# EAGLE design brick_i2c_3axis_MMA8451 (EAGLE 7.2.0)
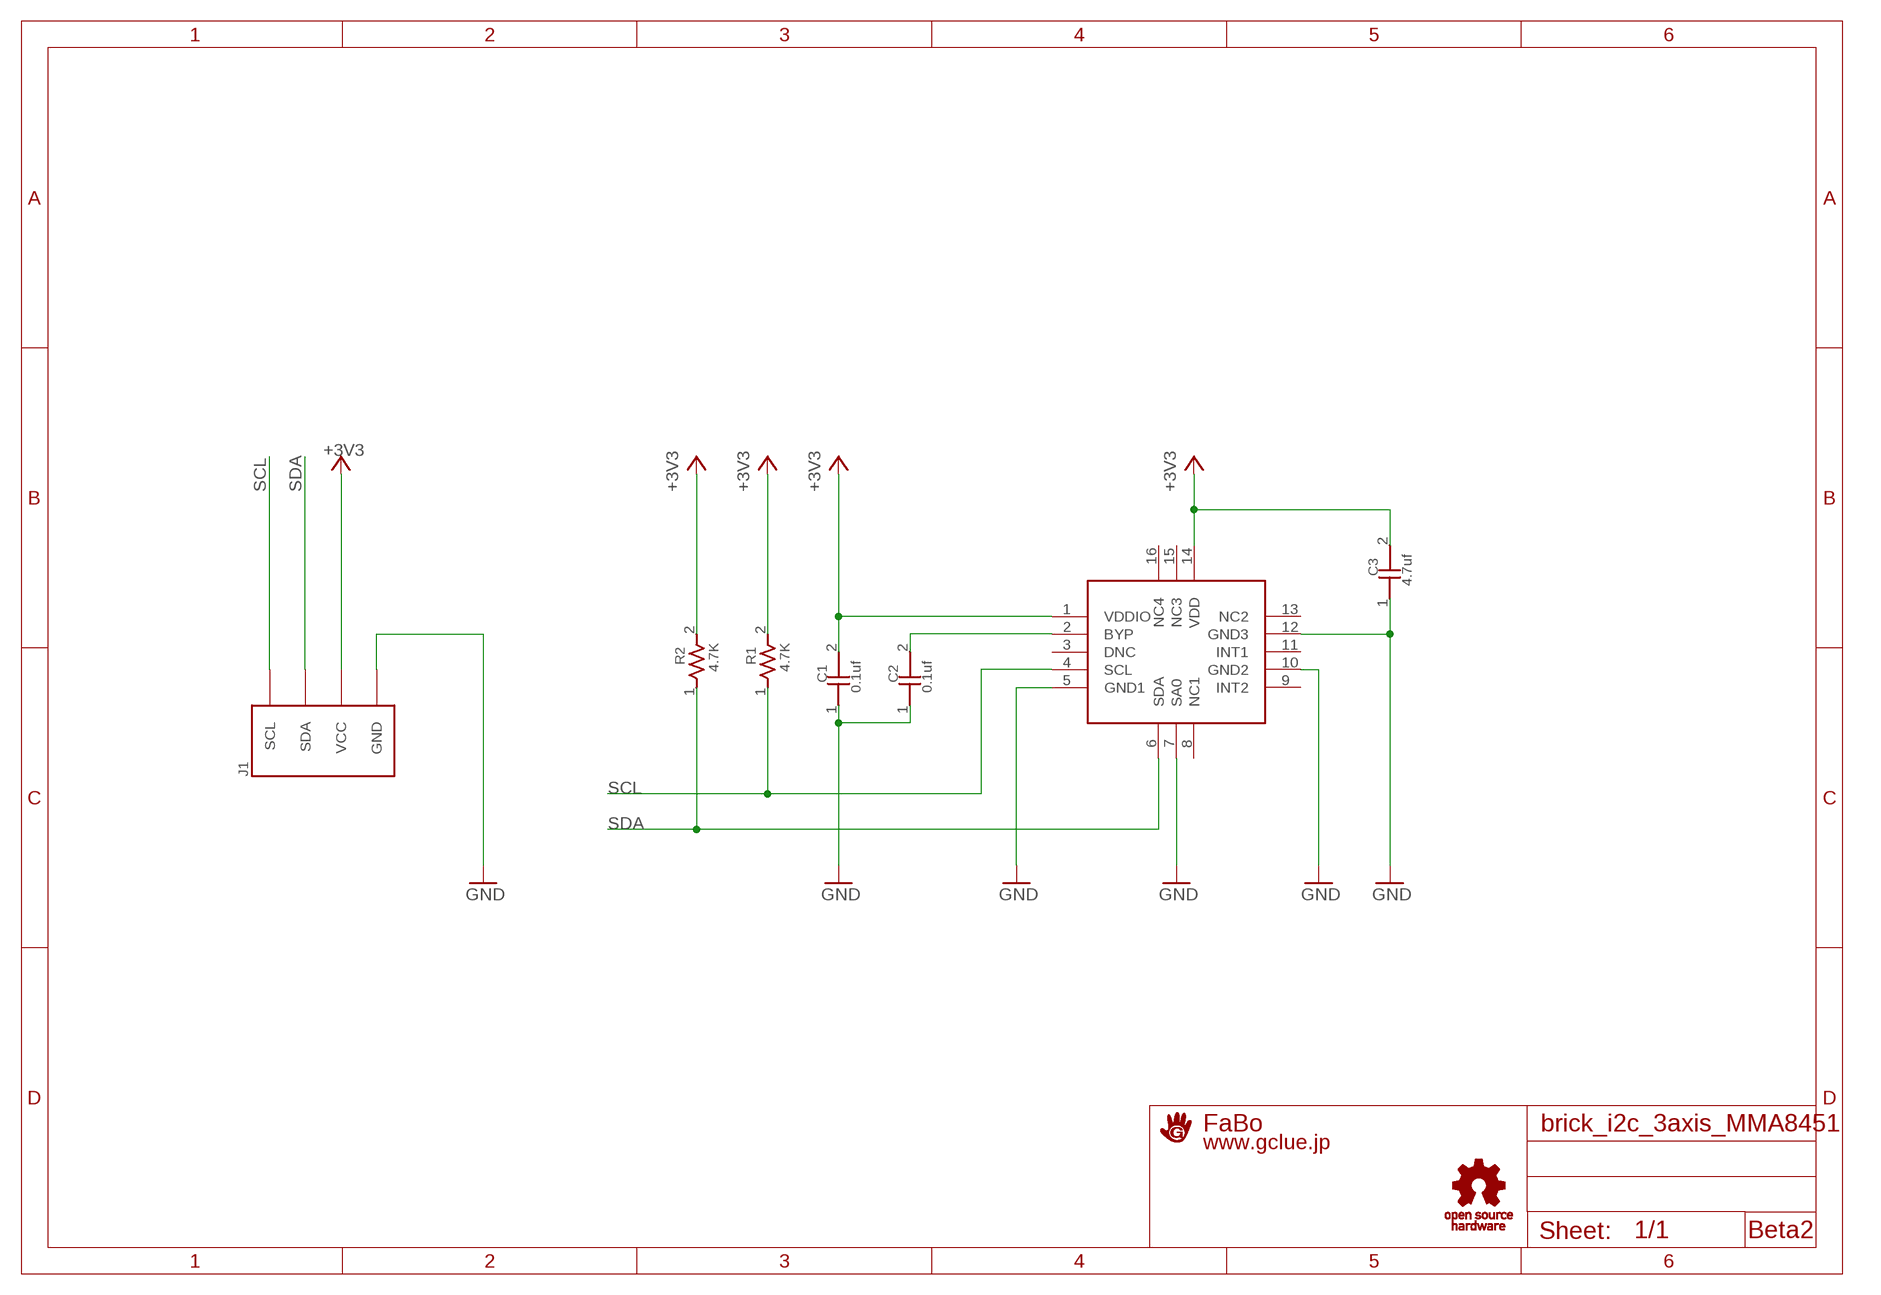
[diagram p0: schematic, sheet 1]

## Parts
C1  0.1uf  CAPACITOR0603  [0603]
C2  0.1uf  CAPACITOR0603  [0603]
C3  4.7uf  CAPACITOR0603  [0603]
J1  BRICK_I2C  [BRICK_I2C]
MMA1  FREESCALE-MMA8451Q  [FREESCALE-MMA8451Q]
R1  4.7K  RESISTOR0603  [0603]
R2  4.7K  RESISTOR0603  [0603]
U$1  LOGO_OSHW_T-M  [LOGO_OSHW_T_M]
U$2  A4L-LOC-FABO_M  [LOGO_FABO_M]

## Nets
+3V3: C1.2 C3.2 J1.VCC MMA1.1(VDDIO) MMA1.14(VDD) R1.2 R2.2
GND: C1.1 C2.1 C3.1 J1.GND MMA1.5(GND1) MMA1.7(SA0) MMA1.10(GND2) MMA1.12(GND3)
N$1: C2.2 MMA1.2(BYP)
SCL: J1.SCL MMA1.4(SCL) R1.1
SDA: J1.SDA MMA1.6(SDA) R2.1
Unconnected: MMA1.3(DNC) MMA1.8(NC1) MMA1.9(INT2) MMA1.11(INT1) MMA1.13(NC2) MMA1.15(NC3) MMA1.16(NC4)

## Notes on the sheet
- Beta2

## Library data of the parts
C1-C3 = GClue-Capacitor:CAPACITOR
J1 = gclue:BRICK_I2C: FaBo Brick 4pin(I2C)
MMA1 = GClue-Mems:FREESCALE-MMA8451Q
R1 R2 = GClue-Resistors:RESISTOR
U$1 = gclue:LOGO_OSHW_T
U$2 = gclue:A4L-LOC: FaBo A4 FRAME

## Board
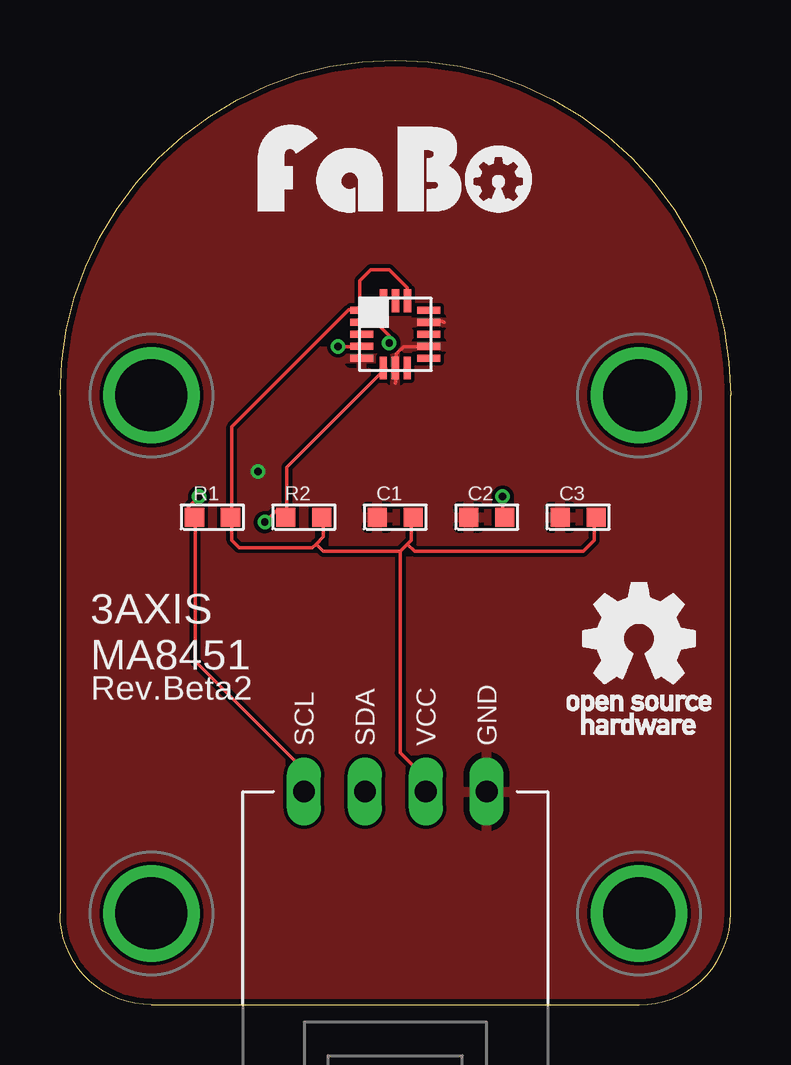
[diagram p1: board, top side]
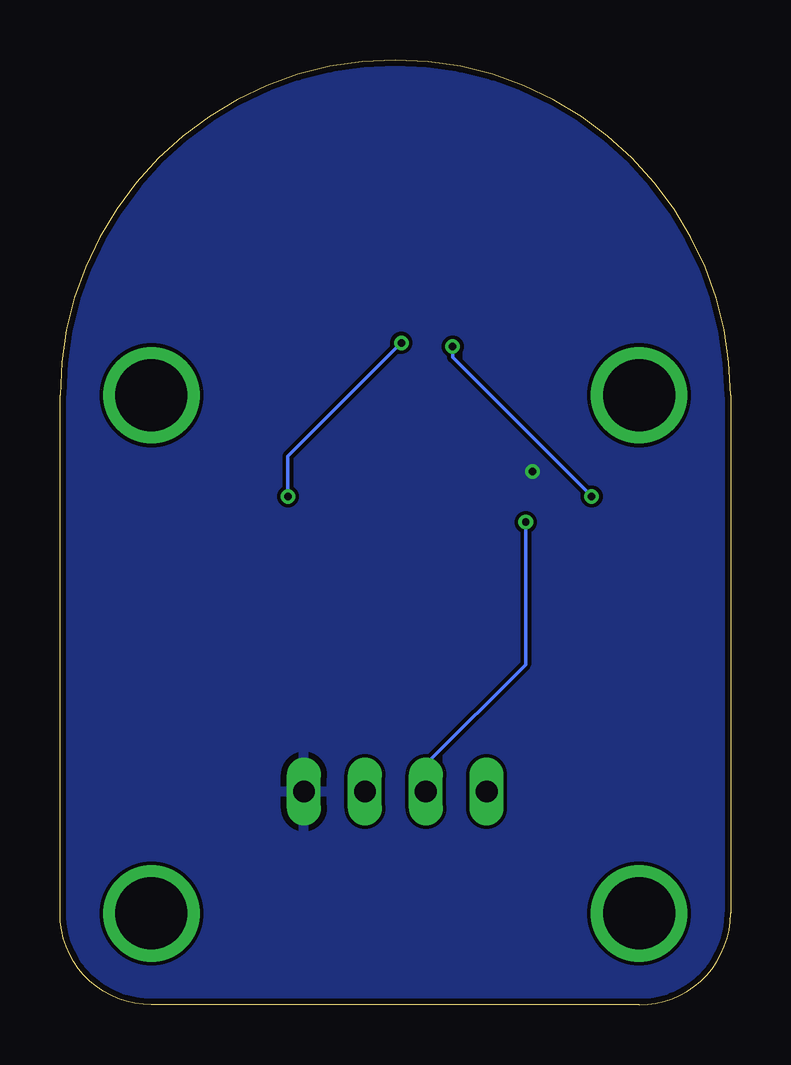
[diagram p2: board, bottom side, seen from below]

Size 27.94 x 39.37 mm. Coordinates in mm from the lower left corner, seen from the top.
Copper layers (1*16): Top 0.035mm / dielectric 1.5mm / Bottom 0.035mm
Design rules "Elecrow_2-layer_eagle_rule": minimum track width 6mil, minimum drill 12mil, track to track 6mil, track to pad 6mil, pad to pad 6mil, via to via 6mil, smd to smd 0mil, copper to edge 10mil, drill to drill 10mil, minimum pad ring 10mil, minimum via ring 6mil, stop-mask expansion 2mil, vias tented up to drill 100mil, thermal gap 10mil

### Footprints (pad centres in the part's own frame; a part is rotated, then mirrored left to right if it is on the bottom)
0603 = smd 0.8 x 0.8: 1 -0.75,0; 2 0.75,0
BRICK_I2C = drill 0.9 long: GND 3.81,-10.16; SCL -3.81,-10.16; SDA -1.27,-10.16; VCC 1.27,-10.16 | drill 3 pad 3.81: P$1 -10.16,6.35; P$2 10.16,6.35; P$3 -10.16,-15.24; P$4 10.16,-15.24
FREESCALE-MMA8451Q = smd 0.95 x 0.305: 1 -1.4,1; 2 -1.4,0.5; 3 -1.4,0; 4 -1.4,-0.5; 5 -1.4,-1; 9 1.4,-1; 10 1.4,-0.5; 11 1.4,0; 12 1.4,0.5; 13 1.4,1 | smd 0.305 x 0.95: 6 -0.5,-1.4; 7 0,-1.4; 8 0.5,-1.4; 14 0.51,1.4; 15 0.01,1.4; 16 -0.49,1.4

### Placement (x,y rotation side)
C1  13.97,20.32 0 top
C2  17.78,20.32 0 top
C3  21.59,20.32 0 top
J1  13.97,19.05 0 top
MMA1  13.97,27.94 0 top
R1  6.35,20.32 0 top
R2  10.16,20.32 0 top
U$1  24.13,15.24 0 top
U$3  [LOGO_FABO_M]  13.97,33.02 0 top

### Tracks (layer width: path | path; a pad name or v marks a point on that pad's centre or on a via)
+3V3
  Top 0.152: 12.5,28.96 12.5,30.18 12.95,30.63 13.72,30.63 14.48,29.87 14.48,29.41 MMA1.14 | 10.67,19.2 10.97,19.51 10.97,20.27 R2.2 | 10.67,19.2 10.52,19.05 7.47,19.05 7.16,19.36 7.16,20.27 R1.2 7.16,20.42 7.16,24.08 12.04,28.96 12.5,28.96 | 14.17,18.9 14.48,19.2 | 14.48,19.2 14.63,19.36 14.63,20.27 C1.2 | 14.17,18.9 10.97,18.9 10.67,19.2 | 14.48,19.2 14.78,18.9 21.79,18.9 22.25,19.36 22.25,20.27 C3.2 | 12.5,28.96 MMA1.1 | J1.VCC 15.24,9.45 14.17,10.52 14.17,18.9
GND  (via drill 0.3)
  Top 0.152: 13.97,25.91 14.02,26.06 14.02,26.52 MMA1.7 14.02,26.67 14.02,27.13 14.33,27.43 15.24,27.43 MMA1.10 | MMA1.12 15.39,28.5 15.85,28.5 16,28.44
  other vias: 8.26,22.23
  pour Bottom: -1.27,-1.27 29.21,-1.27 29.21,40.64 -1.27,40.64
  pour Top: -1.27,-1.27 29.21,-1.27 29.21,40.64 -1.27,40.64
N$1  (via drill 0.3)
  Top 0.152: v18.44,21.18 18.44,20.42 C2.2 | v13.72,27.58 13.72,27.89 13.26,28.35 12.65,28.35 MMA1.2
  Bottom 0.152: v18.44,21.18 18.44,22.86 v13.72,27.58
SCL  (via drill 0.3)
  Top 0.152: J1.SCL 10.06,8.99 10.06,9.91 5.64,14.33 5.64,20.27 R1.1 5.49,20.42 5.33,20.57 5.33,20.73 v5.79,21.18 | v11.58,27.43 12.5,27.43 MMA1.4
  Bottom 0.152: v11.58,27.43 11.58,26.98 v5.79,21.18
SDA  (via drill 0.3)
  Top 0.152: 9.45,20.57 9.45,22.4 13.56,26.52 MMA1.6 | 9.45,20.57 9.45,20.42 R2.1 9.45,20.57 | v8.53,20.12 8.99,20.57 9.45,20.57
  Bottom 0.152: v8.53,20.12 8.53,14.17 12.65,10.06 12.65,8.99 J1.SDA

### Text on the board
tPlace: 3AXIS / MA8451 | Rev.Beta2